# EAGLE design VidBoiMainboardV1 (EAGLE 8.6.0)
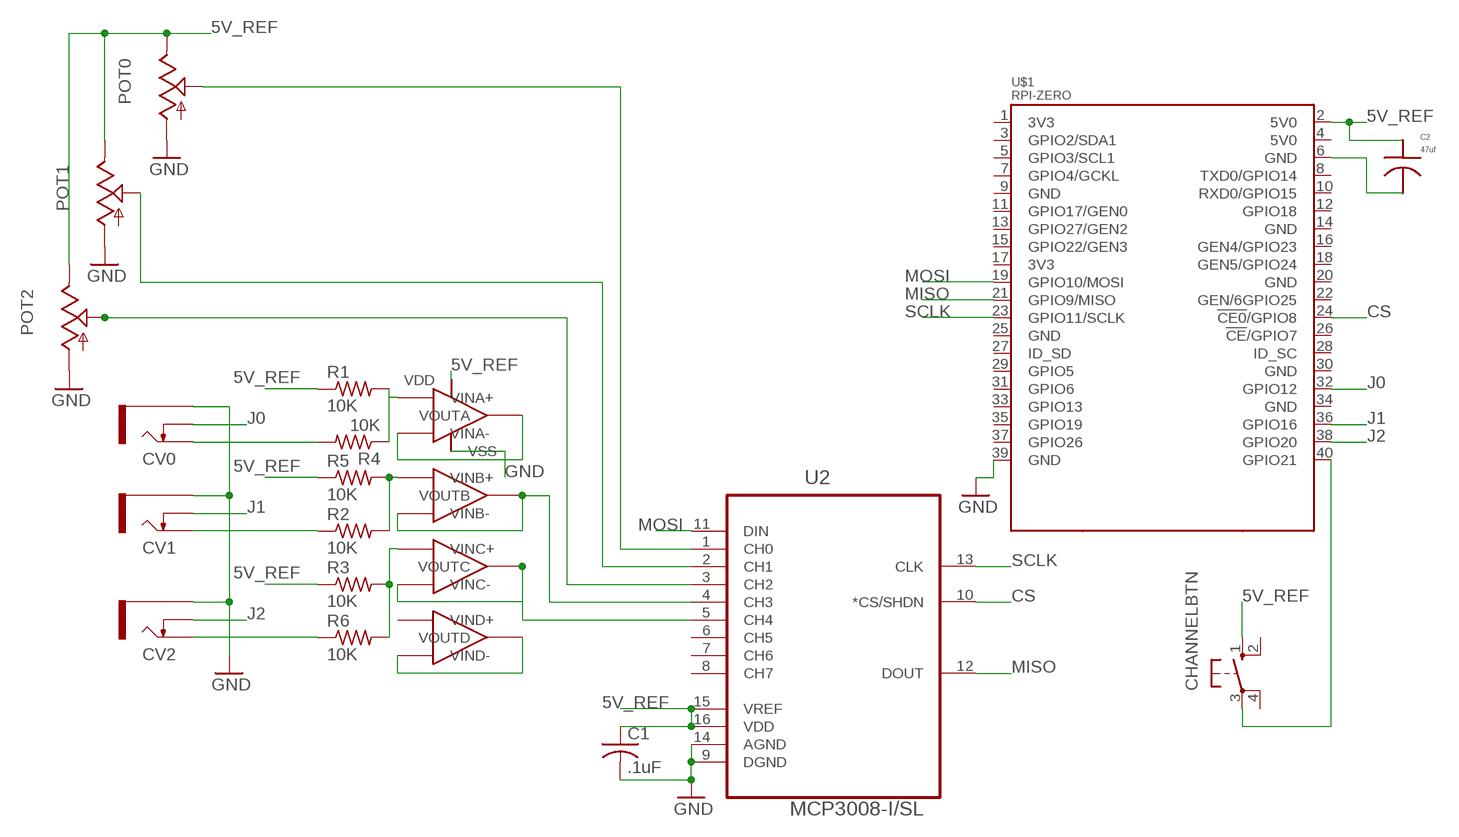
[diagram p0: schematic, sheet 1]

## Parts
C1  .1uF  C-US025-024X044  [C025-024X044]
C2  47uf  PANASONIC_CAP_FKS-V  [CAP-PAN-FKS_V-DIM_C]
CHANNELBTN  10-XX  [B3F-10XX]
CV0  THONKICONNOLD  [THONKICONN]
CV1  THONKICONNOLD  [THONKICONN]
CV2  THONKICONNOLD  [THONKICONN]
POT0  9MM_SNAP-IN_POT_  [9MM_SNAP-IN_POT]
POT1  9MM_SNAP-IN_POT_  [9MM_SNAP-IN_POT]
POT2  9MM_SNAP-IN_POT_  [9MM_SNAP-IN_POT]
R1  10K  R-US_R0603  [R0603]
R2  10K  R-US_R0603  [R0603]
R3  10K  R-US_R0603  [R0603]
R4  10K  R-US_R0603  [R0603]
R5  10K  R-US_R0603  [R0603]
R6  10K  R-US_R0603  [R0603]
U2  MCP3008-I/SL  [SOIC127P600X175-16N]
U$1  RPI-ZERO  [RASPBERRYPI_BASTELSTUBE_V13_RASPI_BOARD_B+_FULL]
U$2  MCP6004SOIC-14  [MCP6004ISL]

## Nets
5V_REF: C1.1 C2.POS CHANNELBTN.1(S) POT0.3(E) POT1.3(E) POT2.3(E) R1.1 R3.1 R5.1 U2.15(VREF) U2.16(VDD) U$1.2(5V0) U$2.VDD
CS: U2.10(*CS/SHDN) U$1.24(!CE0!/GPIO8)
GND: C1.2 CV0.P$1_SLEEVE(SLEEVE) CV1.P$1_SLEEVE(SLEEVE) CV2.P$1_SLEEVE(SLEEVE) POT0.1(A) POT1.1(A) POT2.1(A) U2.9(DGND) U2.14(AGND) U$1.39(GND) U$2.VSS
GND@8: C2.NEG U$1.6(GND)
J0: CV0.P$2_SWITCH(SWITCH) U$1.32(GPIO12)
J1: CV1.P$2_SWITCH(SWITCH) U$1.36(GPIO16)
J2: CV2.P$2_SWITCH(SWITCH) U$1.38(GPIO20)
MISO: U2.12(DOUT) U$1.21(GPIO9/MISO)
MOSI: U2.11(DIN) U$1.19(GPIO10/MOSI)
N$1: CV0.P$3_TIP(TIP) R4.2
N$2: R1.2 R4.1 U$2.VINA+
N$3: CV1.P$3_TIP(TIP) R2.1
N$4: U$2.VINA- U$2.VOUTA
N$5: POT0.2(S) U2.1(CH0)
N$6: POT1.2(S) U2.2(CH1)
N$7: POT2.2(S) U2.3(CH2)
N$8: U2.4(CH3) U$2.VINB- U$2.VOUTB
N$9: R3.2 R6.2 U$2.VINC+
N$10: U2.5(CH4) U$2.VINC- U$2.VOUTC
N$11: U$2.VIND- U$2.VOUTD
N$12: CV2.P$3_TIP(TIP) R6.1
N$15: R2.2 R5.2 U$2.VINB+
N$17: CHANNELBTN.3(P) U$1.40(GPIO21)
SCLK: U2.13(CLK) U$1.23(GPIO11/SCLK)
Unconnected: CHANNELBTN.2(S1) CHANNELBTN.4(P1) U2.6(CH5) U2.7(CH6) U2.8(CH7) U$1.1(3V3) U$1.3(GPIO2/SDA1) U$1.4(5V0) U$1.5(GPIO3/SCL1) U$1.7(GPIO4/GCKL) U$1.8(TXD0/GPIO14) U$1.9(GND) U$1.10(RXD0/GPIO15) U$1.11(GPIO17/GEN0) U$1.12(GPIO18) U$1.13(GPIO27/GEN2) U$1.14(GND) U$1.15(GPIO22/GEN3) U$1.16(GEN4/GPIO23) U$1.17(3V3) U$1.18(GEN5/GPIO24) U$1.20(GND) U$1.22(GEN/6GPIO25) U$1.25(GND) U$1.26(!CE!/GPIO7) U$1.27(ID_SD) U$1.28(ID_SC) U$1.29(GPIO5) U$1.30(GND) U$1.31(GPIO6) U$1.33(GPIO13) U$1.34(GND) U$1.35(GPIO19) U$1.37(GPIO26) U$2.VIND+

## Library data of the parts
C1 = rcl:C-US: CAPACITOR, American symbol; SPICEPREFIX: C
C2 = VidBoi:PANASONIC_CAP_FKS-V: Panasonic Capacitor - FKS Type V
CHANNELBTN = switch-omron:10-XX: OMRON SWITCH; MPN: B3F-1000; OC_FARNELL: 176432; OC_NEWARK: 36M3542
CV0 CV1 CV2 = MusicThingModular:THONKICONN: 3.5mm socket for Eurorack modular synths
POT0 POT1 POT2 = MusicThingModular:9MM_SNAP-IN_POT: 9mm vertical snap-in pot, Alpha / Panasonic style
R1-R6 = rcl:R-US_: RESISTOR, American symbol; SPICEPREFIX: R
U2 = MCP3008-I_SL:MCP3008-I/SL: 10BIT ADC, 8 CH, SPI, SMD; AVAILABILITY: Good; DESCRIPTION: Eight Channel SPI Serial Interface 2.7 V 10-Bit A/D Converter SMT - SOIC-16; MF: Microchip; MP: MCP3008-I/SL; PACKAGE: SOIC-16 Microchip; PRICE: 2.04 USD
U$1 = RPI-Zero:RPI-ZERO
U$2 = VidBoi:MCP6004: MCP6004 - Ronald Sardarian 4 channel Op-Amp

## Net classes
0 default: width 0.305 mm, drill 0.508 mm, clearance 0.254 mm

## Board
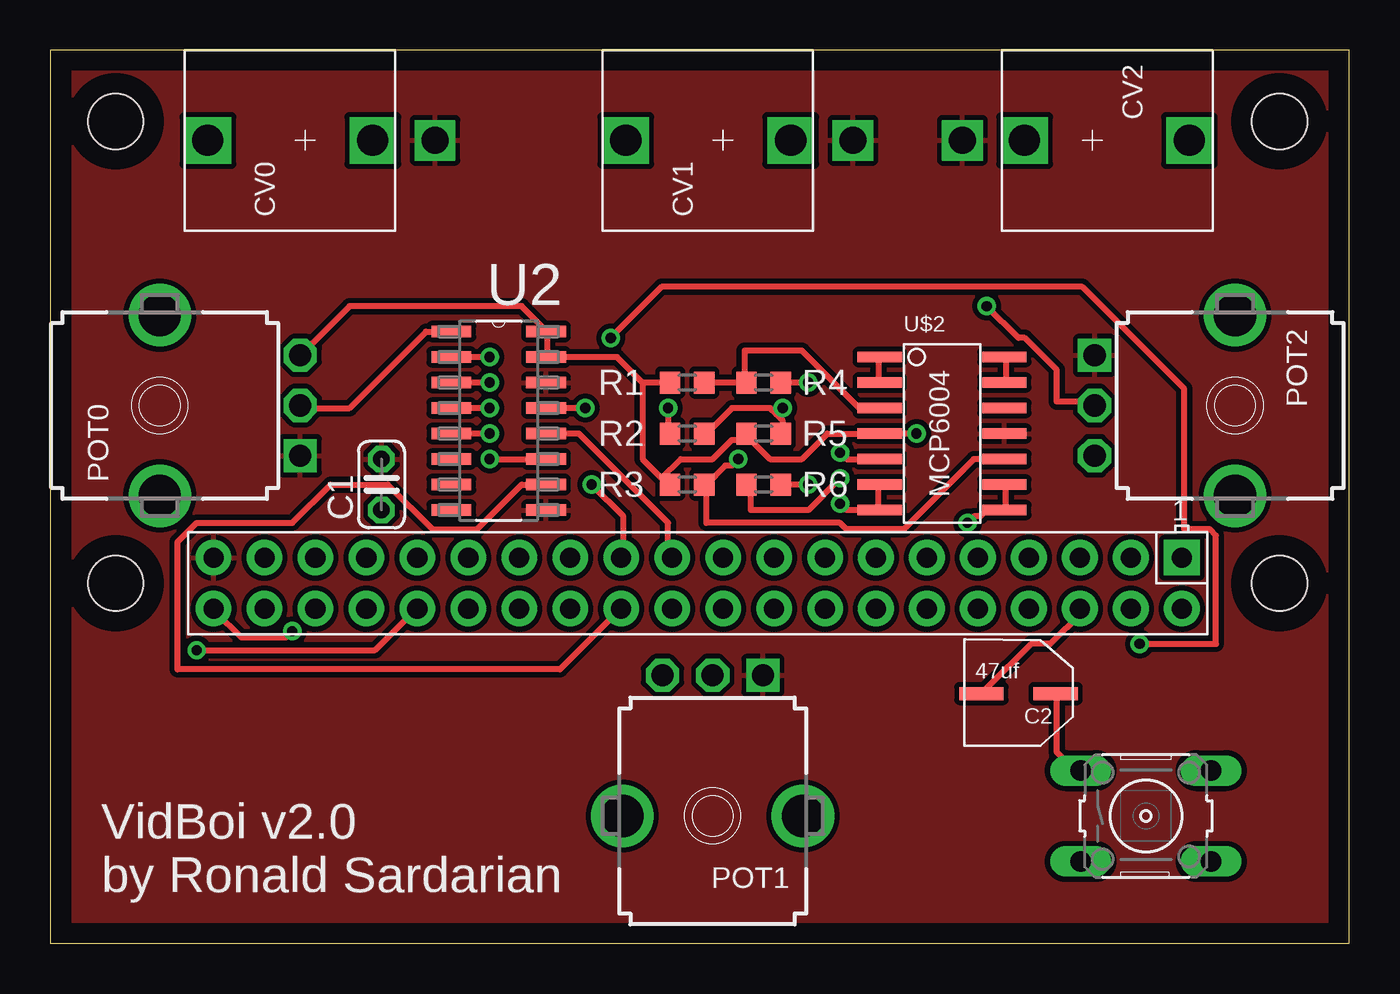
[diagram p1: board, top side]
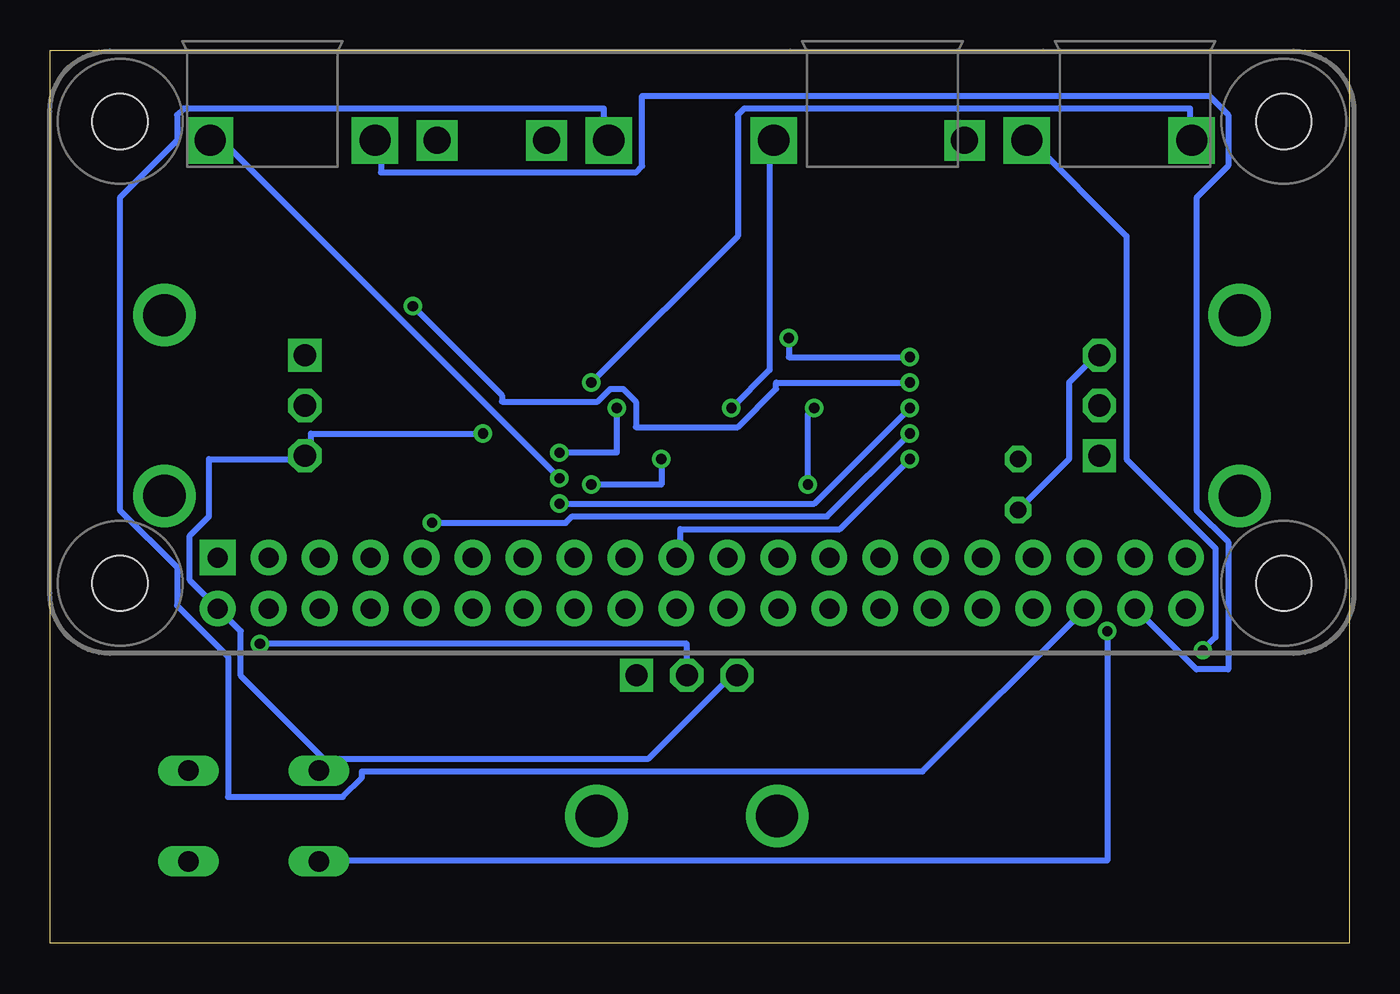
[diagram p2: board, bottom side, seen from below]

Size 64.75 x 44.5 mm. Coordinates in mm from the lower left corner, seen from the top.
Outline: 0,0 64.75,0 64.75,44.5 0,44.5 0,0
Copper layers (1*16): Top 0.035mm / dielectric 1.5mm / Bottom 0.035mm
Design rules "default": minimum track width 6mil, minimum drill 0.35mm, track to track 6mil, track to pad 6mil, pad to pad 6mil, via to via 6mil, smd to smd 6mil, copper to edge 40mil, drill to drill 6mil, minimum pad ring 10mil, minimum via ring 8mil, stop-mask expansion 4mil, vias tented up to drill 0mil, thermal gap 10mil

### Footprints (pad centres in the part's own frame; a part is rotated, then mirrored left to right if it is on the bottom)
C025-024X044 = drill 0.813 octagon: 1 -1.27,0; 2 1.27,0
CAP-PAN-FKS_V-DIM_C = smd 0.65 x 2.2: NEG 0,1.85; POS 0,-1.85
B3F-10XX = drill 1.016 long: 1 -3.251,2.261; 2 3.251,2.261; 3 -3.251,-2.261; 4 3.251,-2.261
THONKICONN = drill 1.35 square: P$1_SLEEVE 0,-6.48 | drill 1.55 square: P$2_SWITCH 0,-3.38; P$3_TIP 0,4.84
9MM_SNAP-IN_POT = drill 1.1 square: 1 -2.5,-7 | drill 1.1 octagon: 2 0,-7; 3 2.5,-7 | drill 2.1 pad 2.794: CHASSIS1 -4.5,0; CHASSIS2 4.5,0
R0603 = smd 1 x 1.1: 1 -0.85,0; 2 0.85,0
SOIC127P600X175-16N = smd 1.981 x 0.559: 1 -2.362,4.445; 2 -2.362,3.175; 3 -2.362,1.905; 4 -2.362,0.635; 5 -2.362,-0.635; 6 -2.362,-1.905; 7 -2.362,-3.175; 8 -2.362,-4.445; 9 2.362,-4.445; 10 2.362,-3.175; 11 2.362,-1.905; 12 2.362,-0.635; 13 2.362,0.635; 14 2.362,1.905; 15 2.362,3.175; 16 2.362,4.445
RASPBERRYPI_BASTELSTUBE_V13_RASPI_BOARD_B+_FULL = drill 1 pad 1.778 square: 1 8.37,25.23 | drill 1 pad 1.778: 2 8.37,27.77; 3 10.91,25.23; 4 10.91,27.77; 5 13.45,25.23; 6 13.45,27.77; 7 15.99,25.23; 8 15.99,27.77; 9 18.53,25.23; 10 18.53,27.77; 11 21.07,25.23; 12 21.07,27.77; 13 23.61,25.23; 14 23.61,27.77; 15 26.15,25.23; 16 26.15,27.77; 17 28.69,25.23; 18 28.69,27.77; 19 31.23,25.23; 20 31.23,27.77; 21 33.77,25.23; 22 33.77,27.77; 23 36.31,25.23; 24 36.31,27.77; 25 38.85,25.23; 26 38.85,27.77; 27 41.39,25.23; 28 41.39,27.77; 29 43.93,25.23; 30 43.93,27.77; 31 46.47,25.23; 32 46.47,27.77; 33 49.01,25.23; 34 49.01,27.77; 35 51.55,25.23; 36 51.55,27.77; 37 54.09,25.23; 38 54.09,27.77; 39 56.63,25.23; 40 56.63,27.77 | hole 2.75: 3.5,3.5; 3.5,26.5; 61.5,3.5; 61.5,26.5
MCP6004ISL = smd 2.21 x 0.51: VDD -3.105,0; VINA+ -3.105,1.27; VINA- -3.105,2.54; VINB+ -3.105,-1.27; VINB- -3.105,-2.54; VINC+ 3.105,-1.27; VINC- 3.105,-2.54; VIND+ 3.105,1.27; VIND- 3.105,2.54; VOUTA -3.105,3.81; VOUTB -3.105,-3.81; VOUTC 3.105,-3.81; VOUTD 3.105,3.81; VSS 3.105,0

### Placement (x,y rotation side)
C1  16.51,22.86 90 top
C2  48.26,12.45 90 top
CHANNELBTN  54.61,6.35 0 top
CV0  12.7,40.01 90 top
CV1  33.53,40.01 90 top
CV2  51.94,40.01 270 top
POT0  5.46,26.8 90 top
POT1  33.02,6.35 180 top
POT2  59.05,26.8 270 top
R1  31.75,27.94 0 top
R2  31.75,25.4 0 top
R3  31.75,22.86 0 top
R4  35.56,27.94 0 top
R5  35.56,25.4 0 top
R6  35.56,22.86 0 top
U2  22.35,26.04 0 top
U$1  64.77,44.45 180 top
U$2  44.45,25.4 0 top

### Tracks (layer width: path | path; a pad name or v marks a point on that pad's centre or on a via)
5V_REF  (via drill 0.51)
  Top 0.305: 24.77,30.48 24.77,29.21 | 30.48,23.18 29.53,24.13 29.53,27.94 | 30.48,23.18 30.8,22.86 R3.1 30.48,23.18 | R1.1 29.53,27.94 | 34.61,25.4 34.29,25.08 33.97,25.08 33.02,24.13 31.43,24.13 30.48,23.18 | 34.61,25.4 35.88,24.13 37.47,24.13 38.73,25.4 U$2.VDD v43.18,25.4 | 34.61,25.4 R5.1 | 24.77,29.21 28.26,29.21 29.53,27.94 | 24.77,29.21 U2.15 | 24.77,30.48 23.5,31.75 14.92,31.75 12.7,29.53 POT0.3 | 24.77,30.48 U2.16 | C2.POS 50.16,12.38 50.16,9.53 50.8,8.89 51.12,8.89 CHANNELBTN.1
  Bottom 0.305: C1.1 13.97,24.13 13.97,27.94 12.7,29.21 POT0.3 | 51.12,9.21 34.92,9.21 30.8,13.34 POT1.3 | 51.12,9.21 51.12,8.89 CHANNELBTN.1 51.12,9.21 | 51.12,9.21 55.24,13.34 55.24,15.56 56.2,16.51 U$1.2 56.52,16.83 57.78,18.1 57.78,20.32 56.83,21.27 56.83,24.13 52.07,24.13 POT2.3 51.75,24.45 51.75,25.4 v43.18,25.4
CS
  Top 0.305: U2.10 23.5,22.86 21.27,20.64 19.05,20.64 16.83,22.86 13.97,22.86 12.06,20.95 7.3,20.95 6.35,20 6.35,13.65 25.4,13.65 28.26,16.51 U$1.24
GND
  pour Top: 1.02,0.64 0.64,44.07 64.39,43.94 64.39,0.64
GND@8
  Top 0.305: C2.NEG 46.67,12.7 48.9,14.92 49.85,14.92 51.44,16.51 U$1.6
J0  (via drill 0.51)
  Top 0.305: v7.3,14.61 16.19,14.61 18.1,16.51 U$1.32
  Bottom 0.305: v7.3,14.61 6.67,15.24 6.67,19.68 11.11,24.13 11.11,35.24 15.88,40.01 CV0.P$2_SWITCH
J1
  Bottom 0.305: U$1.36 13.34,16.51 21.27,8.57 49.21,8.57 49.21,8.26 50.16,7.3 55.88,7.3 55.88,14.29 58.42,16.83 58.42,18.73 61.28,21.59 61.28,37.15 58.42,40.01 58.42,41.27 58.1,41.59 37.15,41.59 37.15,40.01 CV1.P$2_SWITCH
J2
  Bottom 0.305: U$1.38 10.48,16.51 7.62,13.65 6.03,13.65 6.03,20 7.62,21.59 7.62,37.15 6.03,38.73 6.03,41.27 6.99,42.23 35.24,42.23 35.24,38.73 35.56,38.42 48.26,38.42 48.26,40.01 CV2.P$2_SWITCH
MISO
  Top 0.305: U2.12 26.35,25.4 30.8,20.95 30.8,19.37 U$1.21
MOSI  (via drill 0.51)
  Top 0.305: v21.91,24.13 U2.11
  Bottom 0.305: v21.91,24.13 25.4,20.64 33.34,20.64 33.34,19.37 U$1.19
N$1  (via drill 0.51)
  Top 0.305: v37.78,27.94 R4.2
  Bottom 0.305: v37.78,27.94 30.48,35.24 30.48,41.27 30.16,41.59 7.94,41.59 7.94,40.01 CV0.P$3_TIP
N$2
  Top 0.305: 34.61,27.94 R1.2 | 34.61,27.94 34.61,29.53 37.47,29.53 40.32,26.67 U$2.VINA+ | 34.61,27.94 R4.1
N$3  (via drill 0.51)
  Top 0.305: v30.8,26.67 30.8,25.4 R2.1
  Bottom 0.305: v30.8,26.67 28.89,28.57 28.89,40.01 CV1.P$3_TIP
N$4
  Top 0.305: U$2.VINA- 41.27,27.94 41.27,29.21 U$2.VOUTA
N$5
  Top 0.305: U2.1 18.73,30.48 14.92,26.67 12.7,26.67 POT0.2
N$6  (via drill 0.51)
  Top 0.305: v21.91,29.21 U2.2 | v27.94,30.16 30.48,32.7 51.44,32.7 56.52,27.62 56.52,20.64 57.78,20.64 58.1,20.32 58.1,14.92 v54.29,14.92
  Bottom 0.305: v21.91,29.21 27.94,29.21 v27.94,30.16 | v54.29,14.92 33.02,14.92 POT1.2
N$7  (via drill 0.51)
  Top 0.305: v21.91,27.94 U2.3 | v46.67,31.75 48.26,30.16 48.58,30.16 50.16,28.57 50.16,26.99 51.75,26.99 POT2.2
  Bottom 0.305: v21.91,27.94 28.57,27.94 28.57,27.62 30.48,25.72 35.56,25.72 35.56,26.99 36.2,27.62 36.83,27.62 37.47,26.99 42.23,26.99 42.23,27.3 v46.67,31.75
N$8  (via drill 0.51)
  Top 0.305: v21.91,26.67 U2.4 | v39.37,21.91 39.69,21.59 41.27,21.59 | 41.27,21.59 41.27,22.86 U$2.VINB- | 41.27,21.59 U$2.VOUTB
  Bottom 0.305: v21.91,26.67 26.67,21.91 v39.37,21.91
N$9  (via drill 0.51)
  Top 0.305: 32.7,22.86 32.7,20.95 39.37,20.95 39.69,20.64 42.55,20.64 46.04,24.13 U$2.VINC+ | v37.78,22.86 R6.2 | v34.29,24.13 33.97,23.81 33.66,23.81 32.7,22.86 | 32.7,22.86 R3.2
  Bottom 0.305: v37.78,22.86 34.29,22.86 v34.29,24.13
N$10  (via drill 0.51)
  Top 0.305: v21.91,25.4 U2.5 | v45.72,20.95 46.04,21.27 46.35,21.27 46.67,21.59 U$2.VOUTC 47.62,21.59 47.62,22.86 U$2.VINC-
  Bottom 0.305: v21.91,25.4 26.04,21.27 38.73,21.27 39.05,20.95 v45.72,20.95
N$11
  Top 0.305: U$2.VIND- 47.62,27.94 47.62,29.21 U$2.VOUTD
N$12  (via drill 0.51)
  Top 0.305: v39.37,23.18 37.78,21.59 34.92,21.59 34.92,22.86 R6.1
  Bottom 0.305: v39.37,23.18 56.2,40.01 CV2.P$3_TIP
N$15  (via drill 0.51)
  Top 0.305: 36.2,26.35 36.51,26.04 36.51,25.4 R5.2 | 36.2,26.35 35.88,26.67 33.97,26.67 32.7,25.4 R2.2 | U$2.VINB+ 39.69,24.13 v39.37,24.45 | 36.2,26.35 v36.51,26.67
  Bottom 0.305: v39.37,24.45 36.51,24.45 v36.51,26.67
N$17  (via drill 0.51)
  Top 0.305: v12.06,15.56 11.75,15.24 9.53,15.24 8.26,16.51 U$1.40
  Bottom 0.305: v12.06,15.56 12.06,4.13 51.12,4.13 CHANNELBTN.3
SCLK  (via drill 0.51)
  Top 0.305: v26.67,26.67 U2.13 | v26.99,22.86 28.57,21.27 28.57,19.37 U$1.23
  Bottom 0.305: v26.67,26.67 26.99,26.35 v26.99,22.86

### Text on the board
tPlace: VidBoi v2.0 / by Ronald Sardarian